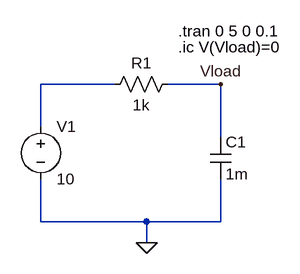
[diagram p0: schematic Experiment 2.asc]
Experiment 2.asc, the LTspice schematic file:
Version 4
SHEET 1 880 680
WIRE 208 48 96 48
WIRE 368 48 288 48
WIRE 96 112 96 48
WIRE 368 128 368 48
WIRE 96 256 96 192
WIRE 256 256 96 256
WIRE 368 256 368 192
WIRE 368 256 256 256
WIRE 256 288 256 256
FLAG 256 288 0
FLAG 368 48 Vload
SYMBOL voltage 96 96 R0
SYMATTR InstName V1
SYMATTR Value 10
SYMBOL cap 352 128 R0
SYMATTR InstName C1
SYMATTR Value 1m
SYMBOL res 304 32 R90
WINDOW 0 0 56 VBottom 2
WINDOW 3 32 56 VTop 2
SYMATTR InstName R1
SYMATTR Value 1k
TEXT 304 -32 Left 2 !.tran 0 5 0 0.1
TEXT 304 -8 Left 2 !.ic V(Vload)=0

The netlist it stands for:
* Experiment 2.asc
V1 N001 0 10
C1 Vload 0 1m
R1 Vload N001 1k
.tran 0 5 0 0.1
.ic V(Vload)=0
.backanno
.end

* Results of the author's LTspice run, read from the files saved beside the schematic
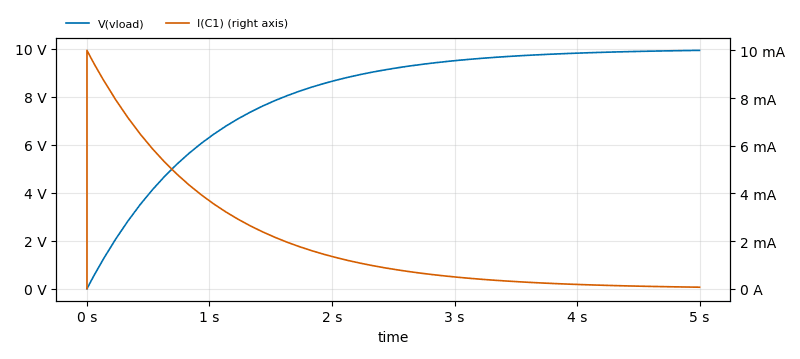
[diagram p1: Transient Analysis of Experiment 2.asc, plotted from the saved traces]
* Transient Analysis, 1 run:
*   V(vload): min 0 V, max 9.933 V, average 8.009 V, rms 8.381 V, last 9.933 V
*   I(C1): min 0 A, max 10 mA, average 1.991 mA, rms 3.172 mA, last 67.11 µA